# Altium project pr1.PrjPcb
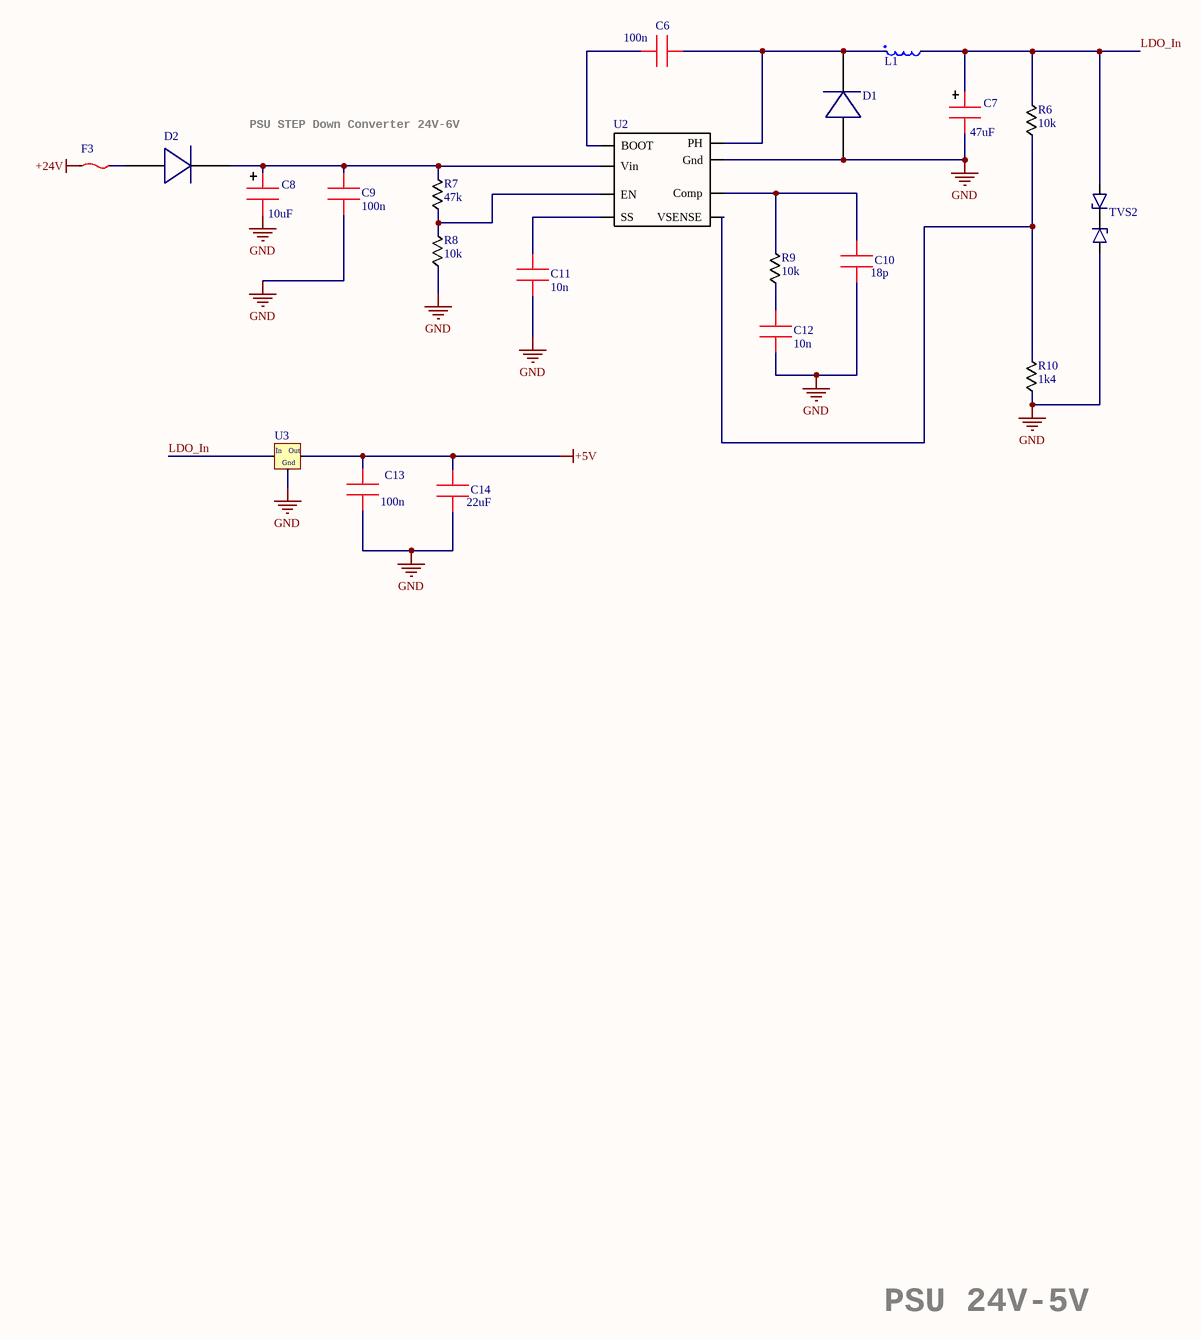
[diagram p0: PSU.SchDoc]
5 sheets, 137 parts. Net scope: global (net labels, ports and power ports of the same name join across sheets).
Board file: PCB DI.PcbDoc
Sheets:
  PSU.SchDoc
  CPU.SchDoc
  X2X.SchDoc
  AFE.SchDoc
  Plugs.SchDoc

## Sheet PSU.SchDoc
size A3

### Parts
C6  100n  [0603 - Cap]
C7  47uF  [1210]
C8  10uF  [1210]
C9  100n  [0603 - Cap]
C10  18p  [0603 - Cap]
C11  10n  [0603 - Cap]
C12  10n  [0603 - Cap]
C13  100n  [0603 - Cap]
C14  22uF  [1206]
D1  (no value)  [B340A-13-F]
D2  (no value)  [B340A-13-F]
F3  (no value)  [MSMF]
L1  (no value)  [SRU1048]
R6  10k  [0603_Res]
R7  47k  [0603_Res]
R8  10k  [0603_Res]
R9  10k  [0603_Res]
R10  1k4  [0603_Res]
TVS2  (no value)  [SM6T]
U2  (no value)  [SOIC 8]
U3  (no value)  [SOT223]

### Nets
+5V: C13.1 C14.2 U3.2(OUT)
+24V: F3.0
GND: C7.2 C8.2 C9.1 C10.1 C11.1 C12.1 C13.2 C14.1 D1.2 R8.1 R10.1 TVS2.1 U2.7(Gnd) U3.1(GND)
LDO_In: C7.1 L1.2 R6.2 TVS2.2 U3.3(IN)
NetC6_1: C6.1 U2.1(BOOT)
NetC6_2: C6.2 D1.1 L1.1 U2.8(PH)
NetC8_1: C8.1 C9.2 D2.1 R7.2 U2.2(Vin)
NetC10_2: C10.2 R9.2 U2.6(Comp)
NetC11_2: C11.2 U2.4(SS)
NetC12_2: C12.2 R9.1
NetD2_2: D2.2 F3.1
NetR6_1: R6.1 R10.2 U2.5(VSENSE)
NetR7_1: R7.1 R8.2 U2.3(EN)

### Notes on the sheet
- PSU STEP Down Converter 24V-6V
- PSU 24V-5V
- (in symbol NCV1117ST50T3G) In; Out; Gnd

### Library data of the parts
C6 C9 = 0805 Cap: Part Description: Ceramic Capacitors SMD 50 V 0.1uF X7R 0603 10%; Part Number: CC0603KRX7R9BB104
C7 = 1206 Cap El: Part Description: Capacitor - SMD 47 uF 10 VDC 10% 1210 X7R; Part Number: GRM32ER71A476KE15L
C8 = 1206 Cap El: Part Description: Ceramic Capacitors SMD 10UF 50V 10% 1210; Part Number: GRM32ER71H106KA12L
C10 = 0805 Cap: Part Description: Cap SMD/SMT 50 V 18 pF C0G 0603 5%; Part Number: CC0603JRNPO9BN180
C11 C12 = 0805 Cap: Part Description: Capacitor SMD 0.01 uF 50 VDC 5% 0603 C0G (NP0); Part Number: GRM1885C1H103JA01D
C13 = Capasitor 0805: CC0603ZRY5V9BB104; Part Description: Ceramic Capacitors SMD 50 V 0.1uF X7R 0603 10%; Part Number: CC0603KRX7R9BB104
C14 = 0805 Cap: Part Description: Cap SMD 16V 22uF X5R 1210 10%; Part Number: CC1210KKX5R7BB226
D1 D2 = B340A-13-F: Part Description: Schottky Diode 60V 3A; Part Number: B360A-13-F
F3 = MSMF: Part Description: PPTC 60V 100MA; Part Number: MF-MSMF010-2
L1 = CDRH127: Part Description: Power Inductor SMD 33uH 30% SMD 1048; Part Number: SRU1048-330Y
R6 R8 R9 = Resistor 0805: Part Description: SMD  Resistor 0603, 10kOhms, 1%, 1/10W; Part Number: RC0603FR-0710KL
R7 = Resistor 0805: RC0603JR-0747K; Part Description: SMD Resistor 0603, 47kOhms, 5%, 1/10W; Part Number: RC0603JR-0747K
R10 = Resistor 0805: Part Description: Thick Film Resistor 0603, 1.4kOhms, 1%, 1/10W; Part Number: RC0603FR-071K4L
TVS2 = SM6T: Part Description: ESD TVS Diode 600W 12V Bidirect; Part Number: SM6T12CA
U2 = TPS54331: Part Description: Switching Voltage Regulators 3A 28V; Part Number: TPS54331
U3 = NCV1117ST50T3G: Part Description: LDO 5V 800MA; Part Number: LM1117MPX-5.0

## Sheet CPU.SchDoc
size A4
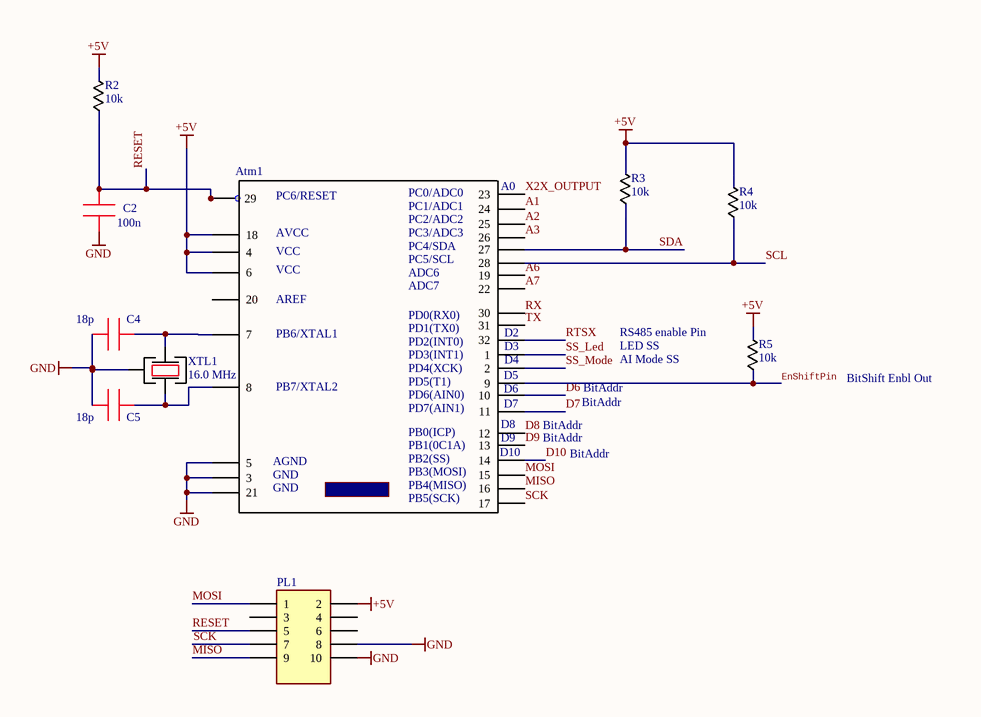
[diagram p1: CPU.SchDoc]

### Parts
Atm1  (no value)  [TQFP]
C2  100n  [0603 - Cap]
C4  18p  [0603 - Cap]
C5  18p  [0603 - Cap]
PL1  (no value)  [IDC-10MS]
R2  10k  [0603_Res]
R3  10k  [0603_Res]
R4  10k  [0603_Res]
R5  10k  [0603_Res]
XTL1  16.0 MHz  [KX-7 XTAL]

### Nets
+5V: Atm1.4 Atm1.6 Atm1.18 PL1.2 R2.2 R3.2 R4.2 R5.2
GND: Atm1.3 Atm1.5 Atm1.21 C2.1 C4.1 C5.1 PL1.8 PL1.10 XTL1.2
A1: Atm1.24
A2: Atm1.25
A3: Atm1.26
A6: Atm1.19
A7: Atm1.22
D6: Atm1.10
D7: Atm1.11
D8: Atm1.12
D9: Atm1.13
D10: Atm1.14
EnShiftPin: Atm1.9 R5.1
MISO: Atm1.16 PL1.9
MOSI: Atm1.15 PL1.1
RESET: Atm1.29 C2.2 PL1.5 R2.1
RTSX: Atm1.32
RX: Atm1.30
SCK: Atm1.17 PL1.7
SCL: Atm1.28 R4.1
SDA: Atm1.27 R3.1
SS_Led: Atm1.1
SS_Mode: Atm1.2
TX: Atm1.31
X2X_OUTPUT: Atm1.23
NetAtm1_7: Atm1.7 C4.2 XTL1.1
NetAtm1_8: Atm1.8 C5.2 XTL1.3

Not connected (* = marked no-connect by the designer): Atm1 20; PL1 3 4 6

### Notes on the sheet
- (near Atm1) A0
- (near Atm1) D3
- (near Atm1) D2
- (near R5) RS485 enable Pin
- LED SS
- (near Atm1) D5
- (near Atm1) D6
- (near Atm1) D7
- (near Atm1) D4
- BitAddr
- AI Mode SS
- BitShift Enbl Out
- (near Atm1) D10
- (near Atm1) D8
- (near Atm1) D9
- (near Atm1) BitAddr
- (in symbol Atmega328) PC6/RESET; PC0/ADC0; PC1/ADC1; PC2/ADC2; AVCC; PC3/ADC3; PC4/SDA; VCC; PC5/SCL; ADC6; ADC7; AREF; PD0(RX0); PD1(TX0); PB6/XTAL1; PD2(INT0); PD3(INT1); PD4(XCK); PD5(T1); PB7/XTAL2; PD6(AIN0); PD7(AIN1); PB0(ICP); PB1(0C1A); PB2(SS); AGND; PB3(MOSI); GND; ATMega328; PB4(MISO); PB5(SCK)

### Library data of the parts
Atm1 = Atmega328: Part Description: 8-bit  MCU 32KB In-system Flash 20MHz 1.8V-5.5V; Part Number: Atmega328P-AU
C2 = Capasitor 0805: as C13 on sheet PSU
C4 C5 = Capasitor 0805: Part Description: Cap SMD/SMT 50 V 18 pF C0G 0603 5%; Part Number: CC0603JRNPO9BN180
PL1 = IDC-10MS: Part Description: IDC Connector 2х5; Part Number: DS1013-10SSIB1-B-0
R2 = Resistor 0805: RT0603FRE0710KL; Part Description: SMD  Resistor 0603, 10kOhms, 1%, 1/10W; Part Number: RC0603FR-0710KL
R3-R5 = Resistor 0805: RC0402FR-0710KL; Part Description: SMD  Resistor 0603, 10kOhms, 1%, 1/10W; Part Number: RC0603FR-0710KL
XTL1 = KX-7: Part Description: Oscillator  16.0 MHz; Part Number: Geyer KX-7 16.0 MHz

## Sheet X2X.SchDoc
size A4
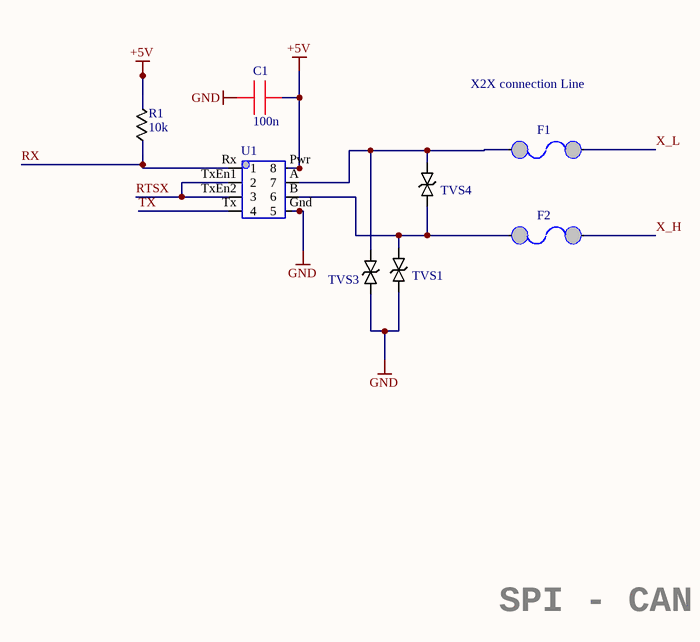
[diagram p2: X2X.SchDoc]

### Parts
C1  100n  [0603 - Cap]
F1  Fuse PTS  [1210_MF]  (value not drawn)
F2  Fuse PTS  [1210_MF]  (value not drawn)
R1  10k  [0603_Res]
TVS1  (no value)  [DO-214AC]
TVS3  (no value)  [DO-214AC]
TVS4  (no value)  [DO-214AC]
U1  (no value)  [MAX485 - duplicate]

### Nets
+5V: C1.1 R1.2 U1.Pwr(8)
GND: C1.2 TVS1.1 TVS3.1 U1.Gnd(5)
RTSX: U1.TxEn1(2) U1.TxEn2(3)
RX: R1.1 U1.Rx(1)
TX: U1.Tx(4)
X_H: F2.1
X_L: F1.1
NetF1_2: F1.2 TVS3.2 TVS4.2 U1.A(7)
NetF2_2: F2.2 TVS1.2 TVS4.1 U1.B(6)

### Notes on the sheet
- X2X connection Line
- SPI - CAN

### Library data of the parts
C1 = 0805 Cap: as C6 on sheet PSU
F1 F2 = Fuse PTS: Part Description: Resettable Fuses - PPTC 30V 50MA; Part Number: MF-USMF005-2
R1 = Resistor 0805: RC0603JR-0710K; Part Description: SMD  Resistor 0603, 10kOhms, 1%, 1/10W; Part Number: RC0603FR-0710KL
TVS1 TVS3 TVS4 = SMAJ5.0CA: Part Description: ESD Diodes 5V 400 W; Part Number: SMAJ5.0CA
U1 = MAX485: Part Description: RS-485 Interface IC Low-Power; Part Number: SN65HVD3082EDR

## Sheet AFE.SchDoc
size A2
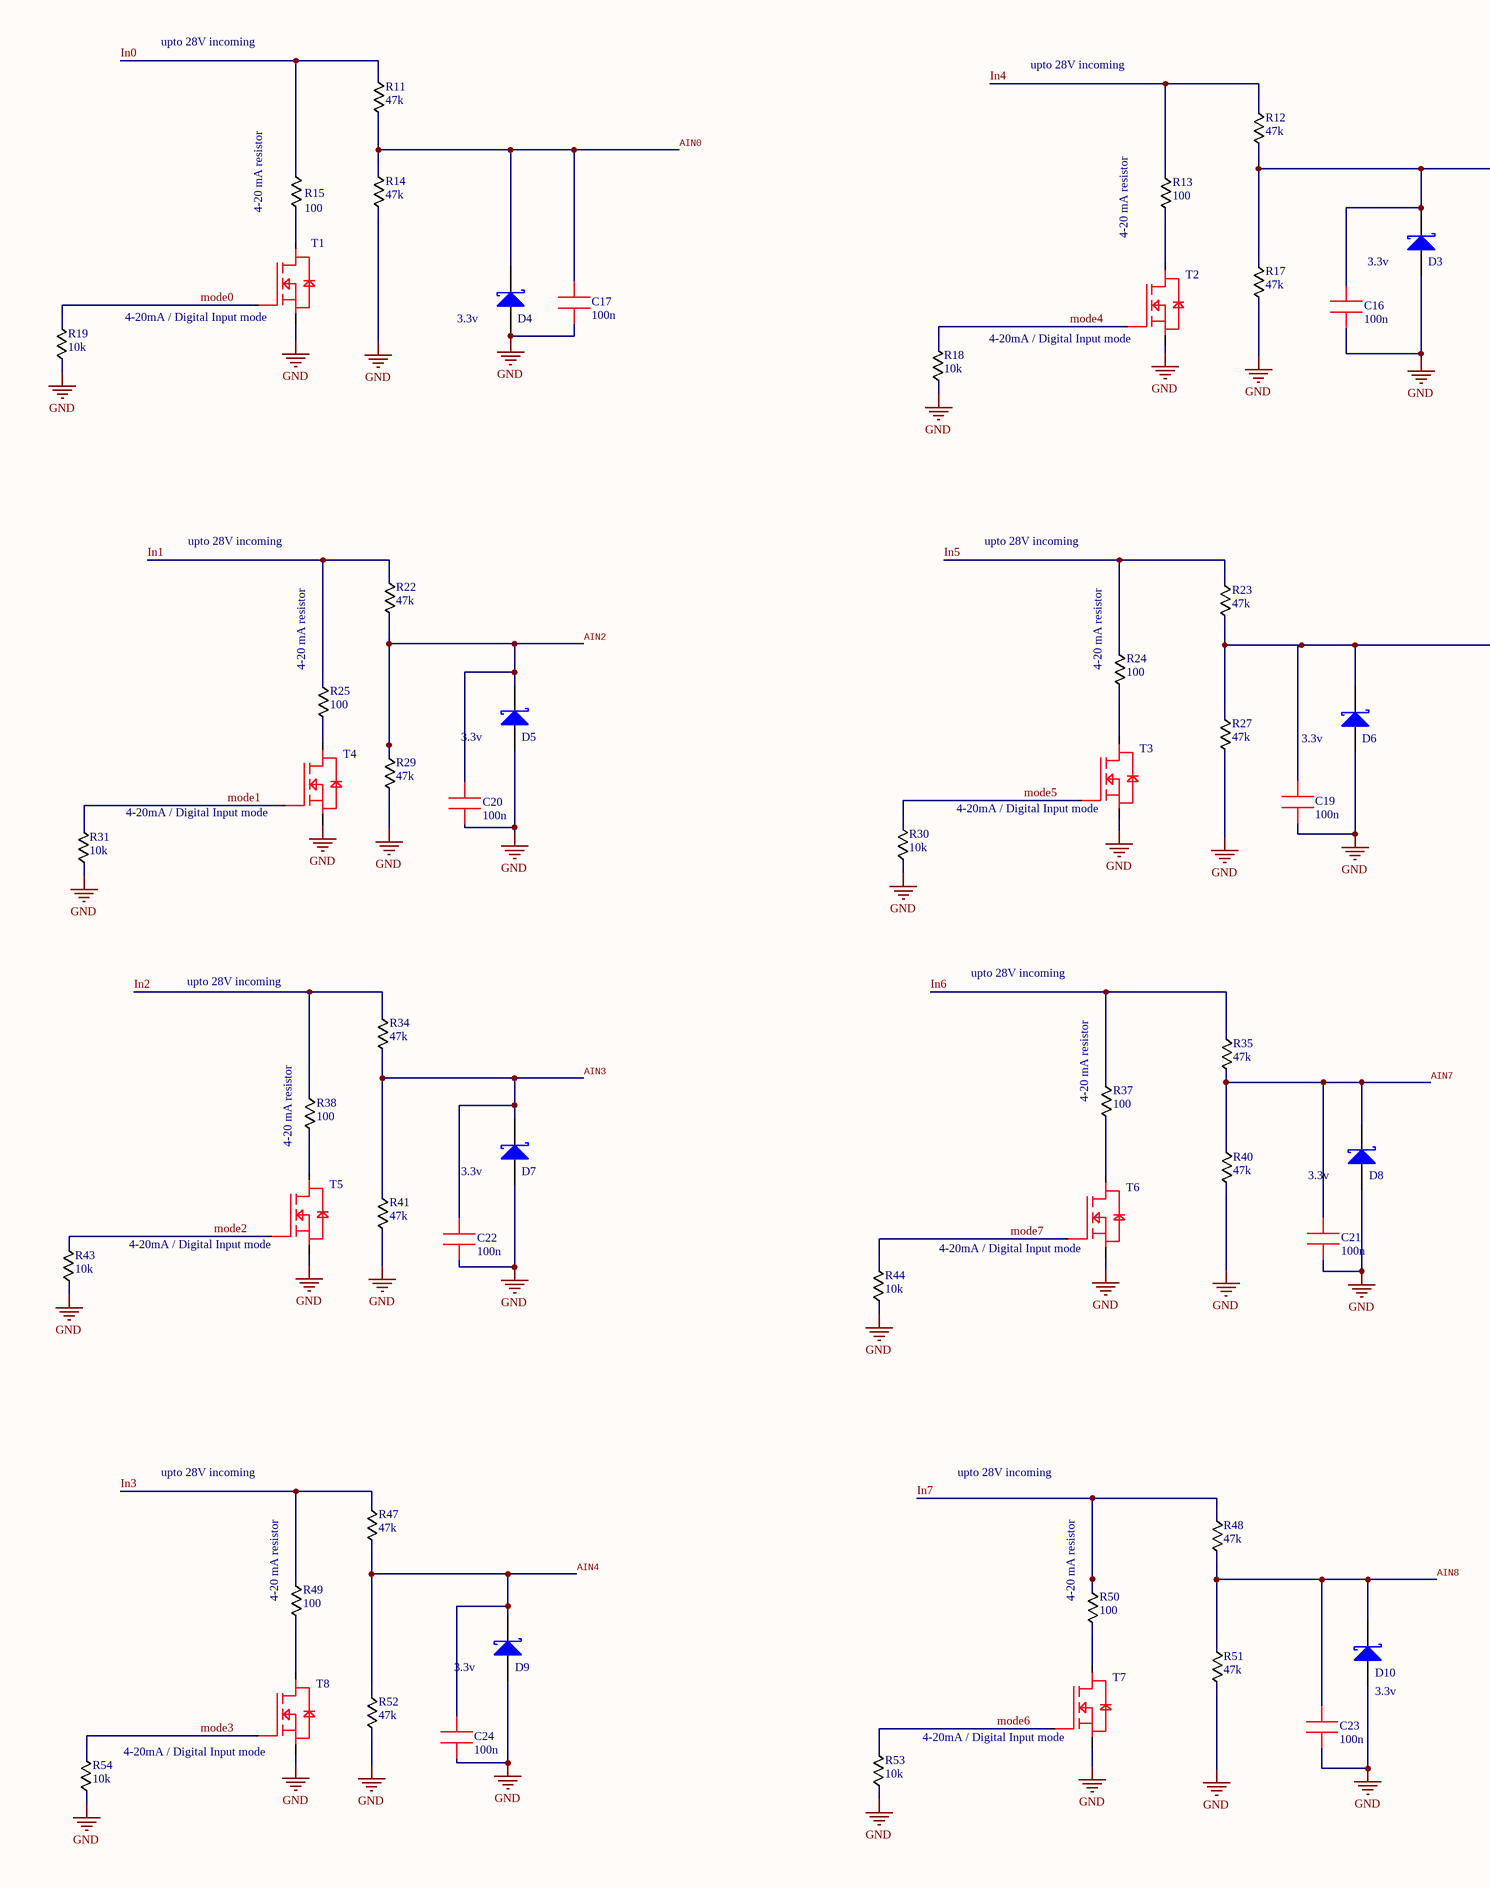
[diagram p3: AFE.SchDoc, left]
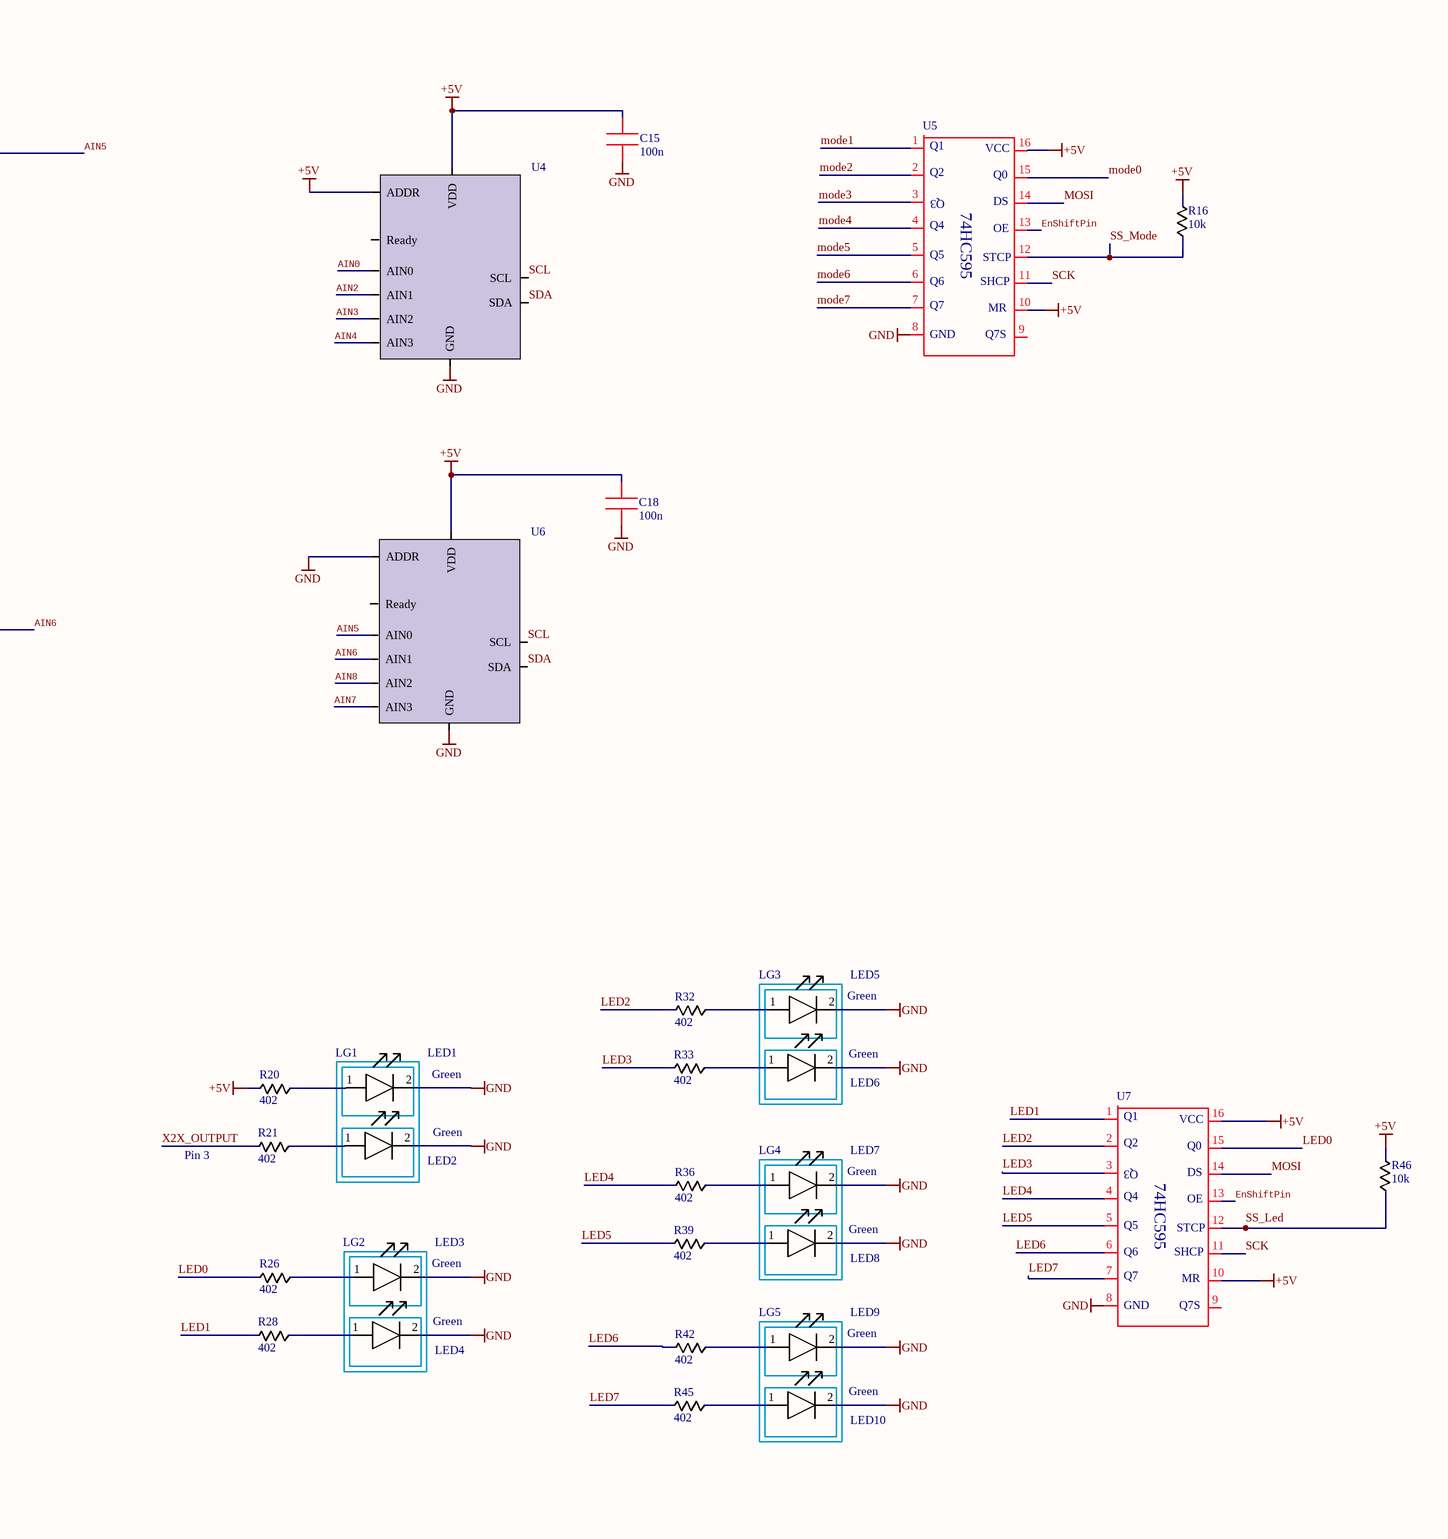
[diagram p4: AFE.SchDoc, right]

### Parts
C15  100n  [0603 - Cap]
C16  100n  [0603 - Cap]
C17  100n  [0603 - Cap]
C18  100n  [0603 - Cap]
C19  100n  [0603 - Cap]
C20  100n  [0603 - Cap]
C21  100n  [0603 - Cap]
C22  100n  [0603 - Cap]
C23  100n  [0603 - Cap]
C24  100n  [0603 - Cap]
D3  3.3v  [SOT23]
D4  3.3v  [SOT23]
D5  3.3v  [SOT23]
D6  3.3v  [SOT23]
D7  3.3v  [SOT23]
D8  3.3v  [SOT23]
D9  3.3v  [SOT23]
D10  3.3v  [SOT23]
LED1  (no value)  [0603 - LED]
LED2  (no value)  [0603 - LED]
LED3  (no value)  [0603 - LED]
LED4  (no value)  [0603 - LED]
LED5  (no value)  [0603 - LED]
LED6  (no value)  [0603 - LED]
LED7  (no value)  [0603 - LED]
LED8  (no value)  [0603 - LED]
LED9  (no value)  [0603 - LED]
LED10  (no value)  [0603 - LED]
LG1  (no value)  [LED SMD DayLight]
LG2  (no value)  [LED SMD DayLight]
LG3  (no value)  [LED SMD DayLight]
LG4  (no value)  [LED SMD DayLight]
LG5  (no value)  [LED SMD DayLight]
R11  47k  [0603_Res]
R12  47k  [0603_Res]
R13  100  [0805_Res]
R14  47k  [0603_Res]
R15  100  [0805_Res]
R16  10k  [0603_Res]
R17  47k  [0603_Res]
R18  10k  [0603_Res]
R19  10k  [0603_Res]
R20  402  [0603_Res]
R21  402  [0603_Res]
R22  47k  [0603_Res]
R23  47k  [0603_Res]
R24  100  [0805_Res]
R25  100  [0805_Res]
R26  402  [0603_Res]
R27  47k  [0603_Res]
R28  402  [0603_Res]
R29  47k  [0603_Res]
R30  10k  [0603_Res]
R31  10k  [0603_Res]
R32  402  [0603_Res]
R33  402  [0603_Res]
R34  47k  [0603_Res]
R35  47k  [0603_Res]
R36  402  [0603_Res]
R37  100  [0805_Res]
R38  100  [0805_Res]
R39  402  [0603_Res]
R40  47k  [0603_Res]
R41  47k  [0603_Res]
R42  402  [0603_Res]
R43  10k  [0603_Res]
R44  10k  [0603_Res]
R45  402  [0603_Res]
R46  10k  [0603_Res]
R47  47k  [0603_Res]
R48  47k  [0603_Res]
R49  100  [0805_Res]
R50  100  [0805_Res]
R51  47k  [0603_Res]
R52  47k  [0603_Res]
R53  10k  [0603_Res]
R54  10k  [0603_Res]
T1  (no value)  [SOT23]
T2  (no value)  [SOT23]
T3  (no value)  [SOT23]
T4  (no value)  [SOT23]
T5  (no value)  [SOT23]
T6  (no value)  [SOT23]
T7  (no value)  [SOT23]
T8  (no value)  [SOT23]
U4  (no value)  [VSSOP-10]
U5  (no value)  [74HC595 Led Driver]
U6  (no value)  [VSSOP-10]
U7  (no value)  [74HC595 Led Driver]

### Nets
+5V: C15.2 C18.2 R16.2 R20.2 R46.2 U4.1(ADDR) U4.8(VDD) U5.10 U5.16 U6.8(VDD) U7.10 U7.16
GND: C15.1 C16.1 C17.1 C18.1 C19.1 C20.1 C21.1 C22.1 C23.1 C24.1 D3.1(A) D4.1(A) D5.1(A) D6.1(A) D7.1(A) D8.1(A) D9.1(A) D10.1(A) LED1.2 LED2.2 LED3.2 LED4.2 LED5.2 LED6.2 LED7.2 LED8.2 LED9.2 LED10.2 R14.2 R17.2 R18.1 R19.1 R27.2 R29.2 R30.1 R31.1 R40.2 R41.2 R43.1 R44.1 R51.2 R52.2 R53.1 R54.1 T1.2 T2.2 T3.2 T4.2 T5.2 T6.2 T7.2 T8.2 U4.3(GND) U5.8 U6.1(ADDR) U6.3(GND) U7.8
AIN0: C17.2 D4.3(K) R11.2 R14.1 U4.4(AIN0)
AIN2: C20.2 D5.3(K) R22.2 R29.1 U4.5(AIN1)
AIN3: C22.2 D7.3(K) R34.2 R41.1 U4.6(AIN2)
AIN4: C24.2 D9.3(K) R47.2 R52.1 U4.7(AIN3)
AIN5: C16.2 D3.3(K) R12.2 R17.1 U6.4(AIN0)
AIN6: C19.2 D6.3(K) R23.2 R27.1 U6.5(AIN1)
AIN7: C21.2 D8.3(K) R35.2 R40.1 U6.7(AIN3)
AIN8: C23.2 D10.3(K) R48.2 R51.1 U6.6(AIN2)
EnShiftPin: U5.13 U7.13
In0: R11.1 R15.1
In1: R22.1 R25.1
In2: R34.1 R38.1
In3: R47.1 R49.1
In4: R12.1 R13.1
In5: R23.1 R24.1
In6: R35.1 R37.1
In7: R48.1 R50.1
LED0: R26.2 U7.15
LED1: R28.2 U7.1
LED2: R32.2 U7.2
LED3: R33.2 U7.3
LED4: R36.2 U7.4
LED5: R39.2 U7.5
LED6: R42.2 U7.6
LED7: R45.2 U7.7
mode0: R19.2 T1.1 U5.15
mode1: R31.2 T4.1 U5.1
mode2: R43.2 T5.1 U5.2
mode3: R54.2 T8.1 U5.3
mode4: R18.2 T2.1 U5.4
mode5: R30.2 T3.1 U5.5
mode6: R53.2 T7.1 U5.6
mode7: R44.2 T6.1 U5.7
MOSI: U5.14 U7.14
SCK: U5.11 U7.11
SCL: U4.10(SCL) U6.10(SCL)
SDA: U4.9(SDA) U6.9(SDA)
SS_Led: R46.1 U7.12
SS_Mode: R16.1 U5.12
X2X_OUTPUT: R21.2
NetLED1_1: LED1.1 R20.1
NetLED2_1: LED2.1 R21.1
NetLED3_1: LED3.1 R26.1
NetLED4_1: LED4.1 R28.1
NetLED5_1: LED5.1 R32.1
NetLED6_1: LED6.1 R33.1
NetLED7_1: LED7.1 R36.1
NetLED8_1: LED8.1 R39.1
NetLED9_1: LED9.1 R42.1
NetLED10_1: LED10.1 R45.1
NetR13_2: R13.2 T2.3
NetR15_2: R15.2 T1.3
NetR24_2: R24.2 T3.3
NetR25_2: R25.2 T4.3
NetR37_2: R37.2 T6.3
NetR38_2: R38.2 T5.3
NetR49_2: R49.2 T8.3
NetR50_2: R50.2 T7.3

Not connected (* = marked no-connect by the designer): U4 2(Ready); U5 9(1); U6 2(Ready); U7 9(1)

### Notes on the sheet
- upto 28V incoming
- 4-20 mA resistor
- (near T1) 4-20mA / Digital Input mode
- (near T2) 4-20mA / Digital Input mode
- (near R25) 4-20 mA resistor
- (near R24) 4-20 mA resistor
- (near T4) 4-20mA / Digital Input mode
- (near T3) 4-20mA / Digital Input mode
- (near LED5) Green
- (near R37) 4-20 mA resistor
- (near LED1) Green
- Green
- (near R38) 4-20 mA resistor
- (near R21) Pin 3
- (near T5) 4-20mA / Digital Input mode
- (near T6) 4-20mA / Digital Input mode
- (near LED7) Green
- (near LED3) Green
- (near LED9) Green
- (near R49) 4-20 mA resistor
- (near R50) 4-20 mA resistor
- (near T8) 4-20mA / Digital Input mode
- (near T7) 4-20mA / Digital Input mode
- (in symbol 74HC595 Led Driver) Q1; VCC; Q2; Q0; Q3; DS; Q4; OE; Q5; STCP; Q6; SHCP; Q7; MR; GND; Q7S

### Library data of the parts
C15-C24 = 0805 Cap: as C6 on sheet PSU
D3-D10 = Diode BAT17: Part Description: Zener, SOT-23, 3.3V, 0.3W, 2%; Part Number: BZX84B3V3; Note: Pin 2 is not connected and not drawn.; Published: 21-Mar-2003; LatestRevisionDate: 29-May-2009; LatestRevisionNote: IPC-7351 Footprint Added.; DatasheetVersion: Oct-1999; PackageVersion: Sep-2001; PackageReference: SOT-23; Publisher: Altium Limited; PackageDescription: 3-Pin SOT-23 Package 0.95 mm Pitch, 2.5 mm Lead Span; ComponentLink1Description: Manufacturer Link; ComponentLink1URL: http://www.infineon.com/; ComponentLink2Description: Datasheet; ComponentLink2URL: http://www.infineon.com/upload/Document/cmc_upload/documents/009/363/bat17series.pdf
LED1-LED10 = LED 0603: Part Number: KP-1608SGC; Part Description: 0603 Single Colour LED Green
LG1-LG5 = Light Guide 2: Part Number: 5151094F; Part Description: Light Guide
R11 R12 R14 R17 R22 R23 R27 R29 R34 R35 R40 R41 R47 R48 R51 R52 = Resistor 0805: Part Description: Resistor 0603, 47kOhms, 1%, 1/10W; Part Number: RC0603FR-0747KL
R13 R15 R24 R25 R37 R38 R49 R50 = Resistor 0805: Part Description: Resistor SMD 1/8W 100 ohm .1% 25p pm; Part Number: RT0805BRD07100RL
R16 R46 = Resistor 0805: as R1 on sheet X2X
R18 R19 R30 R31 R43 R44 R53 R54 = Resistor 0805: as R6 on sheet PSU
R20 R21 R26 R28 R32 R33 R36 R39 R42 R45 = Resistor 0805: RC0603FR-07402RL; Part Description: Resistor 0603, 402Ohms, 1%, 1/10W; Part Number: RC0603FR-07402RL
T1-T8 = IRLML2402: Part Description: MOSFET SOT-23 N-CH LOGIC; Part Number: BSS138
U4 U6 = ADS1115: Part Description: ADC 16B ADC 4ch MUX; Part Number: ADS1115IDGSR
U5 U7 = 74HC595 Led Driver: Part Description: 8-Bit Shift Register/Latch; Part Number: 74HC595

## Sheet Plugs.SchDoc
size A4
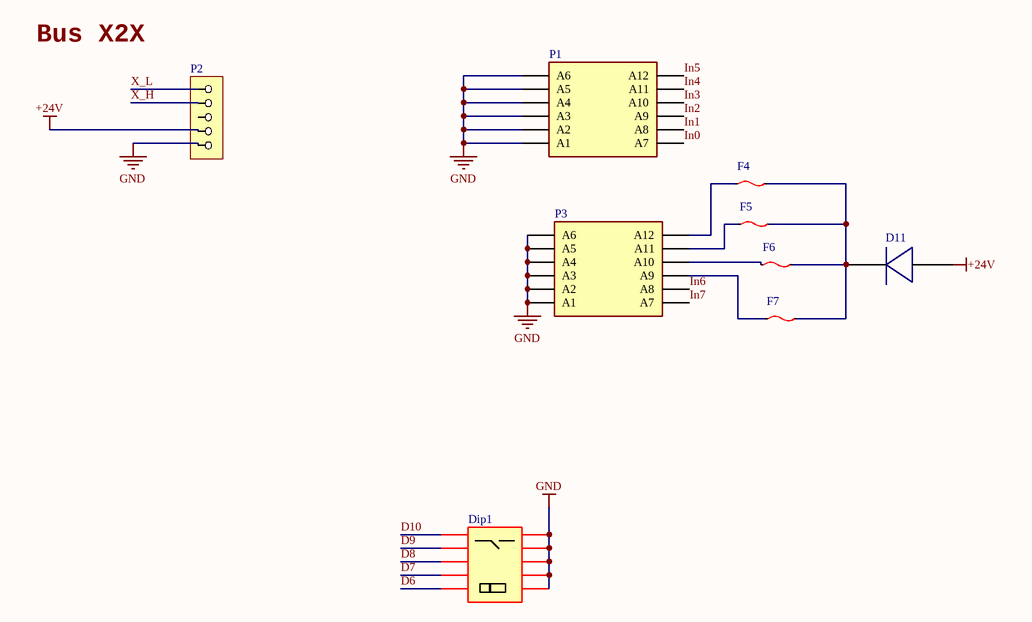
[diagram p5: Plugs.SchDoc]

### Parts
D11  (no value)  [B340A-13-F]
Dip1  (no value)  [DipSwitch 5]
F4  (no value)  [MSMF]
F5  (no value)  [MSMF]
F6  (no value)  [MSMF]
F7  (no value)  [MSMF]
P1  (no value)  [mcd 1,5/6-G1-3.81]
P2  (no value)  [PhClass5]
P3  (no value)  [mcd 1,5/6-G1-3.81]

### Nets
+24V: D11.2 P2.4
GND: Dip1.1 Dip1.2 Dip1.3 Dip1.4 Dip1.5 P1.1(A6) P1.3(A5) P1.5(A4) P1.7(A3) P1.9(A2) P1.11(A1) P2.5 P3.1(A6) P3.3(A5) P3.5(A4) P3.7(A3) P3.9(A2) P3.11(A1)
D6: Dip1.16
D7: Dip1.15
D8: Dip1.14
D9: Dip1.13
D10: Dip1.12
In0: P1.12(A7)
In1: P1.10(A8)
In2: P1.8(A9)
In3: P1.6(A10)
In4: P1.4(A11)
In5: P1.2(A12)
In6: P3.10(A8)
In7: P3.12(A7)
X_H: P2.2
X_L: P2.1
NetD11_1: D11.1 F4.1 F5.1 F6.1 F7.1
NetF4_0: F4.0 P3.2(A12)
NetF5_0: F5.0 P3.4(A11)
NetF6_0: F6.0 P3.6(A10)
NetF7_0: F7.0 P3.8(A9)

Not connected (* = marked no-connect by the designer): P2 3

### Notes on the sheet
- Bus X2X

### Library data of the parts
D11 = B340A-13-F: as D1 on sheet PSU
Dip1 = DipSwitch5: Part Description: Bit Switch; Part Number: DS1040-05RT
F4-F7 = MSMF: as F3 on sheet PSU
P1 P3 = MCD 1.5/6 Phoenix: Part Description: Pluggable Terminal Blocks; LatestRevisionDate: 17-Jul-2002; LatestRevisionNote: Re-released for DXP Platform.; Publisher: Altium Limited; Part Number: MCD 1.5/6 Phoenix
P2 = EMSTBA 2.5/5-G-5.08: Part Description: Pluggable Terminal Blocks 5 Pos; Part Number: MSTBA 2,5/ 5-G-5,08 - 1757271

## Nets that join several sheets
+5V: PSU (C13.1 C14.2 U3.2), CPU (8 pins), X2X (C1.1 R1.2 U1.Pwr), AFE (12 pins)
+24V: PSU (F3.0), Plugs (D11.2 P2.4)
GND: PSU (14 pins), CPU (9 pins), X2X (C1.2 TVS1.1 TVS3.1 U1.Gnd), AFE (57 pins), Plugs (18 pins)
D6: CPU (Atm1.10), Plugs (Dip1.16)
D7: CPU (Atm1.11), Plugs (Dip1.15)
D8: CPU (Atm1.12), Plugs (Dip1.14)
D9: CPU (Atm1.13), Plugs (Dip1.13)
D10: CPU (Atm1.14), Plugs (Dip1.12)
EnShiftPin: CPU (Atm1.9 R5.1), AFE (U5.13 U7.13)
In0: AFE (R11.1 R15.1), Plugs (P1.12)
In1: AFE (R22.1 R25.1), Plugs (P1.10)
In2: AFE (R34.1 R38.1), Plugs (P1.8)
In3: AFE (R47.1 R49.1), Plugs (P1.6)
In4: AFE (R12.1 R13.1), Plugs (P1.4)
In5: AFE (R23.1 R24.1), Plugs (P1.2)
In6: AFE (R35.1 R37.1), Plugs (P3.10)
In7: AFE (R48.1 R50.1), Plugs (P3.12)
MOSI: CPU (Atm1.15 PL1.1), AFE (U5.14 U7.14)
RTSX: CPU (Atm1.32), X2X (U1.TxEn1 U1.TxEn2)
RX: CPU (Atm1.30), X2X (R1.1 U1.Rx)
SCK: CPU (Atm1.17 PL1.7), AFE (U5.11 U7.11)
SCL: CPU (Atm1.28 R4.1), AFE (U4.10 U6.10)
SDA: CPU (Atm1.27 R3.1), AFE (U4.9 U6.9)
SS_Led: CPU (Atm1.1), AFE (R46.1 U7.12)
SS_Mode: CPU (Atm1.2), AFE (R16.1 U5.12)
TX: CPU (Atm1.31), X2X (U1.Tx)
X2X_OUTPUT: CPU (Atm1.23), AFE (R21.2)
X_H: X2X (F2.1), Plugs (P2.2)
X_L: X2X (F1.1), Plugs (P2.1)